# EAGLE design sds3_pcb_rev1 (EAGLE 6.4)
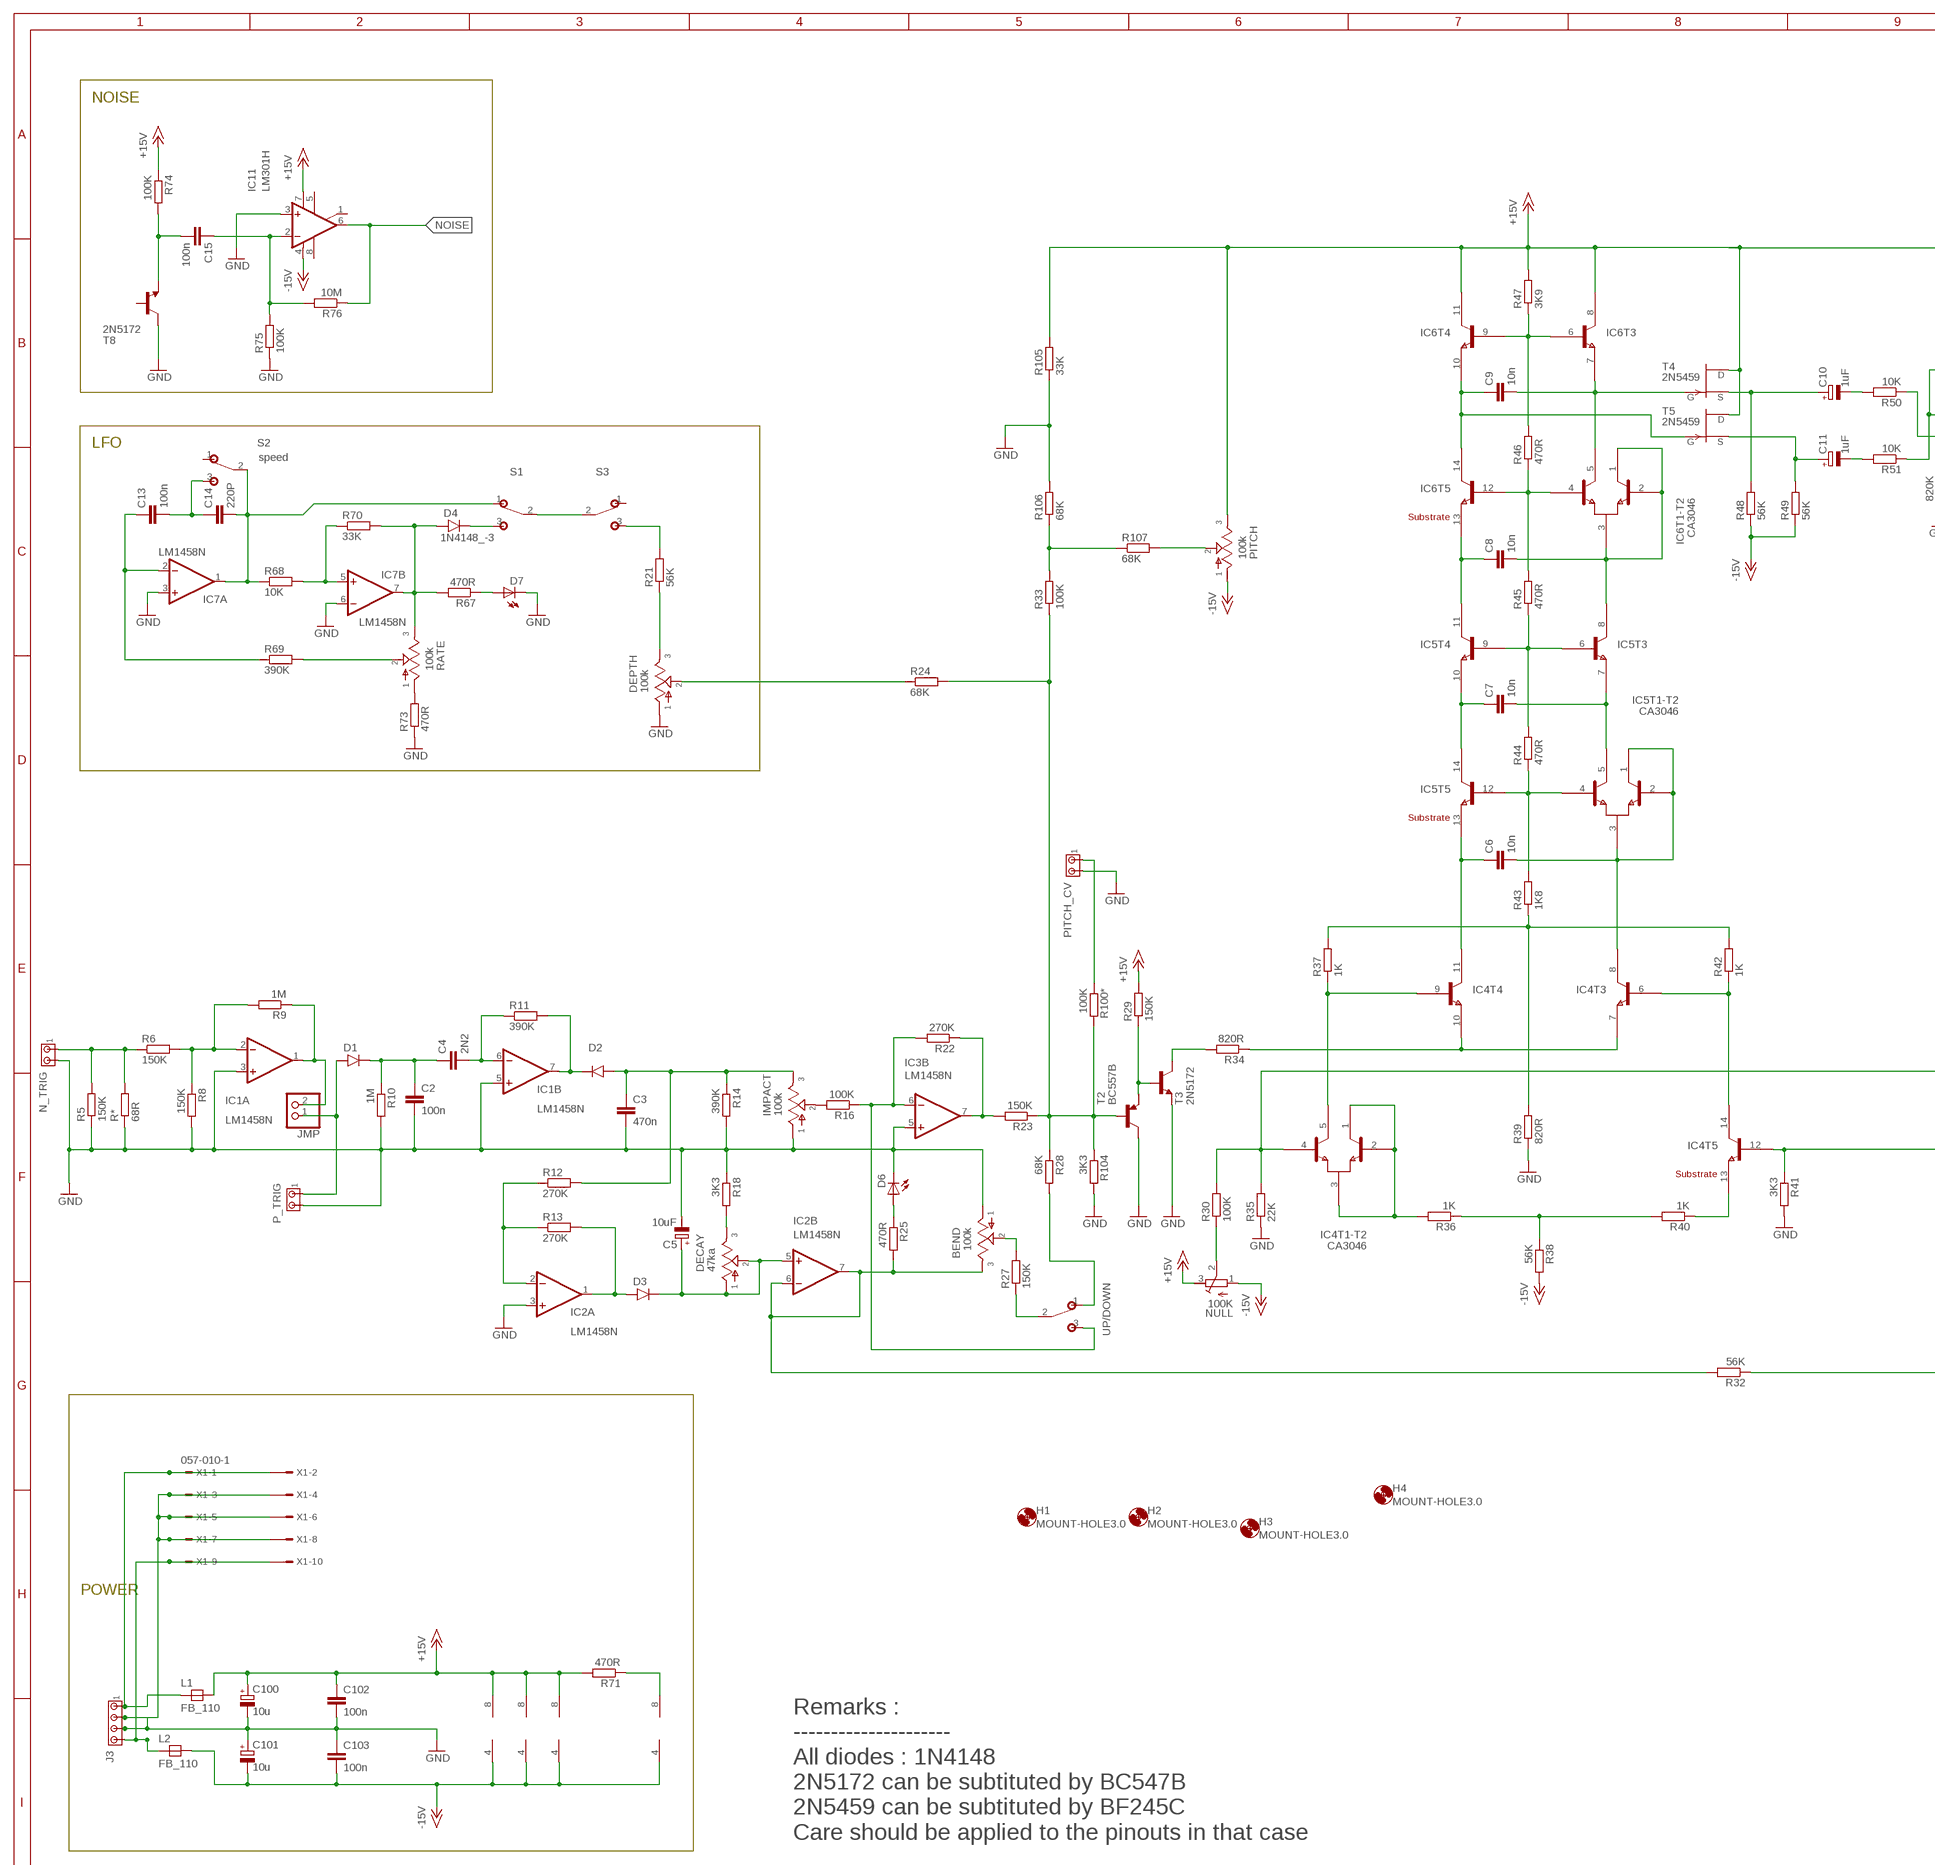
[diagram p0: schematic, sheet 1, part 1 of 2]
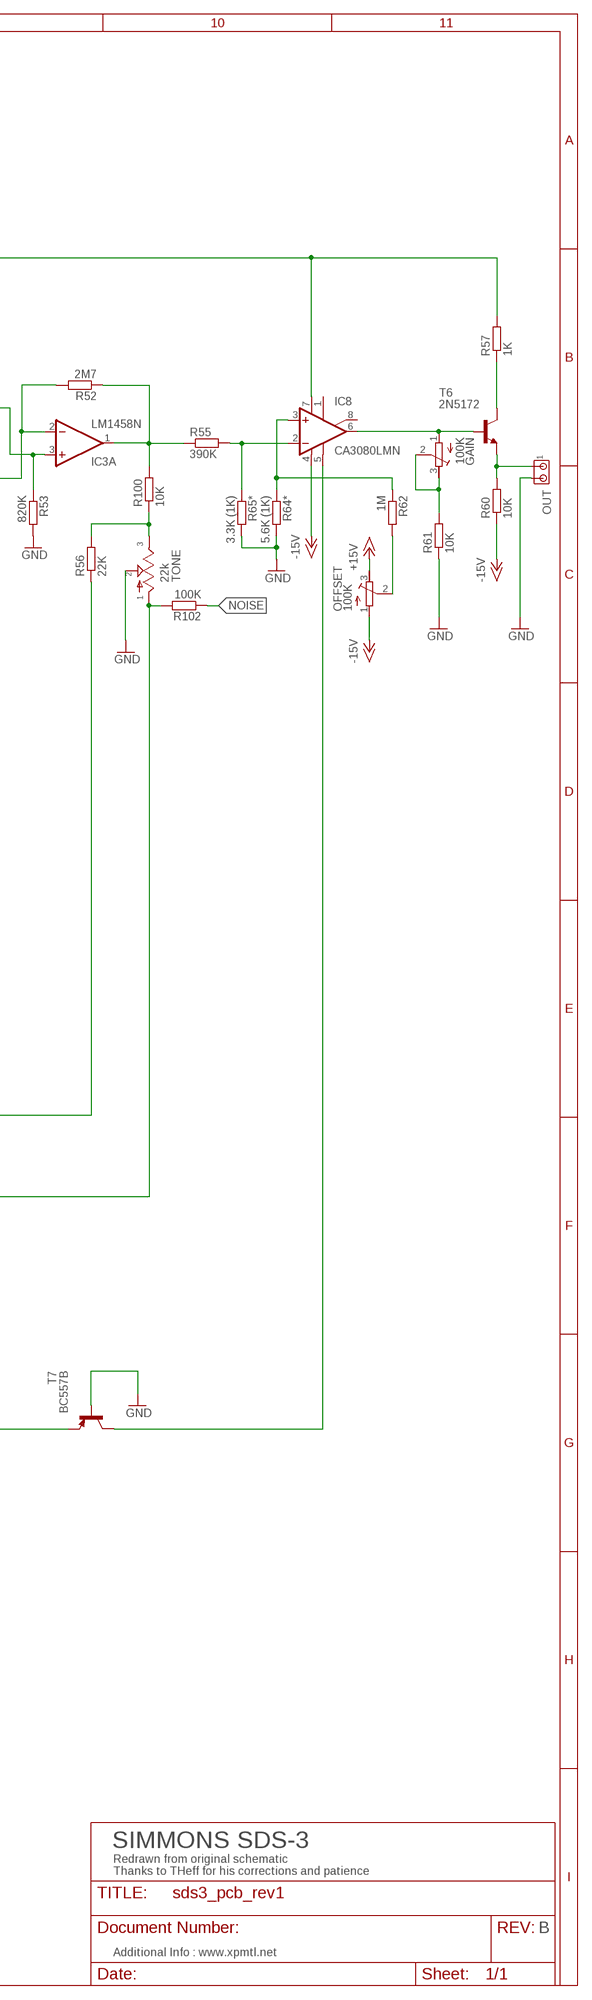
[diagram p1: schematic, sheet 1, part 2 of 2]

## Parts
BEND  100k  POT  [POT]
C2  100n  C-EU050-025X075  [C050-025X075]
C3  470n  C-EU050-025X075  [C050-025X075]
C4  2N2  C-EU050-025X075  [C050-025X075]
C5  10uF  CPOL-EUE2.5-6  [E2,5-6]
C6  10n  C-EU050-025X075  [C050-025X075]
C7  10n  C-EU050-025X075  [C050-025X075]
C8  10n  C-EU050-025X075  [C050-025X075]
C9  10n  C-EU050-025X075  [C050-025X075]
C10  1uF  CPOL-EUE2.5-6  [E2,5-6]
C11  1uF  CPOL-EUE2.5-6  [E2,5-6]
C13  100n  C-EU050-025X075  [C050-025X075]
C14  220P  C-EU050-025X075  [C050-025X075]
C15  100n  C-EU050-025X075  [C050-025X075]
C100  10u  CPOL-EUB45181A  [B45181A]
C101  10u  CPOL-EUB45181A  [B45181A]
C102  100n  C-EU050-025X075  [C050-025X075]
C103  100n  C-EU050-025X075  [C050-025X075]
D1  1N4148_-3  [DO35-3]
D2  1N4148_-3  [DO35-3]
D3  1N4148_-3  [DO35-3]
D4  1N4148_-3  [DO35-3]
D6  LED5MM  [LED5MM]
D7  LED5MM  [LED5MM]
DECAY  47ka  POT  [POT]
DEPTH  100k  POT  [POT]
GAIN  100K  R-TRIMM3296W  [RTRIM3296W]
H1  MOUNT-HOLE3.0  [3,0]
H2  MOUNT-HOLE3.0  [3,0]
H3  MOUNT-HOLE3.0  [3,0]
H4  MOUNT-HOLE3.0  [3,0]
IC1  LM1458N  [DIL08]
IC2  LM1458N  [DIL08]
IC3  LM1458N  [DIL08]
IC4  CA3046  [DIL14]
IC5  CA3046  [DIL14]
IC6  CA3046  [DIL14]
IC7  LM1458N  [DIL08]
IC8  CA3080LMN  [DIL08]
IC11  LM301H  [DIL08]
IMPACT  100k  POT  [POT]
J3  MTA04-156  [1X4MTA]
JMP  PINHD-1X2  [1X02]
L1  FB_110  [FB-110]
L2  FB_110  [FB-110]
N_TRIG  MTA02-100  [10X02MTA]
NULL  100K  R-TRIMM3296W  [RTRIM3296W]
OFFSET  100K  R-TRIMM3296W  [RTRIM3296W]
OUT  MTA02-100  [10X02MTA]
P_TRIG  MTA02-100  [10X02MTA]
PITCH  100k  POT  [POT]
PITCH_CV  MTA02-100  [10X02MTA]
R5  150K  R-EU_0309/V  [0309V]
R6  150K  R-EU_0309/V  [0309V]
R8  150K  R-EU_0309/V  [0309V]
R9  1M  R-EU_0309/V  [0309V]
R10  1M  R-EU_0309/V  [0309V]
R11  390K  R-EU_0309/V  [0309V]
R12  270K  R-EU_0309/V  [0309V]
R13  270K  R-EU_0309/V  [0309V]
R14  390K  R-EU_0309/V  [0309V]
R16  100K  R-EU_0309/V  [0309V]
R18  3K3  R-EU_0309/V  [0309V]
R21  56K  R-EU_0309/V  [0309V]
R22  270K  R-EU_0309/V  [0309V]
R23  150K  R-EU_0309/V  [0309V]
R24  68K  R-EU_0309/V  [0309V]
R25  470R  R-EU_0309/V  [0309V]
R27  150K  R-EU_0309/V  [0309V]
R28  68K  R-EU_0309/V  [0309V]
R29  150K  R-EU_0309/V  [0309V]
R30  100K  R-EU_0309/V  [0309V]
R32  56K  R-EU_0309/V  [0309V]
R33  100K  R-EU_0309/V  [0309V]
R34  820R  R-EU_0309/V  [0309V]
R35  22K  R-EU_0309/V  [0309V]
R36  1K  R-EU_0309/V  [0309V]
R37  1K  R-EU_0309/V  [0309V]
R38  56K  R-EU_0309/V  [0309V]
R39  820R  R-EU_0309/V  [0309V]
R40  1K  R-EU_0309/V  [0309V]
R41  3K3  R-EU_0309/V  [0309V]
R42  1K  R-EU_0309/V  [0309V]
R43  1K8  R-EU_0309/V  [0309V]
R44  470R  R-EU_0309/V  [0309V]
R45  470R  R-EU_0309/V  [0309V]
R46  470R  R-EU_0309/V  [0309V]
R47  3K9  R-EU_0309/V  [0309V]
R48  56K  R-EU_0309/V  [0309V]
R49  56K  R-EU_0309/V  [0309V]
R50  10K  R-EU_0309/V  [0309V]
R51  10K  R-EU_0309/V  [0309V]
R52  2M7  R-EU_0309/V  [0309V]
R53  820K  R-EU_0309/V  [0309V]
R55  390K  R-EU_0309/V  [0309V]
R56  22K  R-EU_0309/V  [0309V]
R57  1K  R-EU_0309/V  [0309V]
R60  10K  R-EU_0309/V  [0309V]
R61  10K  R-EU_0309/V  [0309V]
R62  1M  R-EU_0309/V  [0309V]
R64*  5.6K (1K)  R-EU_0309/V  [0309V]
R65*  3.3K (1K)  R-EU_0309/V  [0309V]
R67  470R  R-EU_0309/V  [0309V]
R68  10K  R-EU_0309/V  [0309V]
R69  390K  R-EU_0309/V  [0309V]
R70  33K  R-EU_0309/V  [0309V]
R71  470R  R-EU_0309/V  [0309V]
R73  470R  R-EU_0309/V  [0309V]
R74  100K  R-EU_0309/V  [0309V]
R75  100K  R-EU_0309/V  [0309V]
R76  10M  R-EU_0309/V  [0309V]
R100  10K  R-EU_0309/V  [0309V]
R100*  100K  R-EU_0309/V  [0309V]
R102  100K  R-EU_0309/V  [0309V]
R104  3K3  R-EU_0309/V  [0309V]
R105  33K  R-EU_0309/V  [0309V]
R106  68K  R-EU_0309/V  [0309V]
R107  68K  R-EU_0309/V  [0309V]
R*  68R  R-EU_0309/V  [0309V]
RATE  100k  POT  [POT]
S1  shape  SPDTPADS  [SPDT]
S2  speed  SPDTPADS  [SPDT]
S3  on/off  SPDTPADS  [SPDT]
T2  BC557B  [TO92-EBC]
T3  2N5172  [TO92-LINE]
T4  2N5459  [TO92-FET2]
T5  2N5459  [TO92-FET2]
T6  2N5172  [TO92-LINE]
T7  BC557B  [TO92-EBC]
T8  2N5172  [TO92-LINE]
TONE  22k  POT  [POT]
UP/DOWN  SPDTPADS  [SPDT]
X1  057-010-1  [057-010-1]

## Nets
+15V [nvcc]: C100.+ C102.1 IC1.8(P:V+) IC2.8(P:V+) IC3.8(P:V+) IC6.8(T3:C) IC6.11(T4:C) IC8.7(V+) IC11.7(V+) L1.2 NULL.3(E) OFFSET.3(E) PITCH.3 R29.2 R47.2 R57.2 R71.2 R74.1 R105.2 T4.D T5.D
-15V [nvcc]: C101.- C103.2 IC1.4(P:V-) IC2.4(P:V-) IC3.4(P:V-) IC7.4(P:V-) IC8.4(V-) IC11.4(V-) L2.2 NULL.1(A) OFFSET.1(A) PITCH.1 R38.2 R48.1 R49.1 R60.1
GND [gnd]: BEND.1 C2.2 C3.2 C5.- C100.- C101.+ C102.2 C103.1 D6.K(C) D7.K(C) DEPTH.1 IC1.3(A:+IN) IC1.5(B:+IN) IC2.3(A:+IN) IC3.5(B:+IN) IC7.3(A:+IN) IC7.6(B:-IN) IC11.3(+IN) IMPACT.1 J3.2 J3.3 N_TRIG.2 OUT.2 P_TRIG.2 PITCH_CV.2 R5.1 R8.2 R10.2 R14.2 R18.1 R35.1 R39.1 R41.2 R53.2 R61.1 R64*.2 R65*.2 R73.1 R75.1 R104.2 R105.1 R106.2 R*.1 T2.C T3.E T7.B T8.C TONE.2 X1.3 X1.4 X1.5 X1.6 X1.7 X1.8
N$1: C9.1 IC6.10(T4:E) IC6.14(T5:C) T5.G
N$2: IC6.4(T1-T2:B2) IC6.12(T5:B) R45.2 R46.1
N$3: C9.2 IC6.5(T1-T2:C2) IC6.7(T3:E) T4.G
N$4: IC6.6(T3:B) IC6.9(T4:B) R46.2 R47.1
N$5: C11.- R51.2
N$6: C8.1 IC5.11(T4:C) IC6.13(T5:E)
N$7: C8.2 IC5.8(T3:C) IC6.1(T1-T2:C1) IC6.2(T1-T2:B1) IC6.3(T1-T2:E)
N$8: IC5.6(T3:B) IC5.9(T4:B) R44.2 R45.1
N$9: C7.1 IC5.10(T4:E) IC5.14(T5:C)
N$10: C7.2 IC5.5(T1-T2:C2) IC5.7(T3:E)
N$11: IC5.4(T1-T2:B2) IC5.12(T5:B) R43.2 R44.1
N$12: C6.1 IC4.11(T4:C) IC5.13(T5:E)
N$13: C6.2 IC4.8(T3:C) IC5.1(T1-T2:C1) IC5.2(T1-T2:B1) IC5.3(T1-T2:E)
N$14: IC4.6(T3:B) IC4.14(T5:C) R42.1
N$15: IC4.5(T1-T2:C2) IC4.9(T4:B) R37.1
N$16: R37.2 R39.2 R42.2 R43.1
N$17: IC4.7(T3:E) IC4.10(T4:E) R34.1
N$18: IC4.1(T1-T2:C1) IC4.2(T1-T2:B1) IC4.3(T1-T2:E) R36.2
N$19: R36.1 R38.1 R40.2
N$20: IC4.13(T5:E) R40.1
N$22: IC4.4(T1-T2:B2) R30.2 R35.2 R56.1
N$23: C10.- R50.2
N$24: C10.+ R48.2 T4.S
N$25: C11.+ R49.2 T5.S
N$26: IC3.3(A:+IN) R50.1 R53.1
N$27: IC3.2(A:-IN) R51.1 R52.2
N$28: IC3.1(A:OUT) R52.1 R55.1 R100.2
N$29: IC8.2(-IN) R55.2 R65*.1
N$30: IC8.3(+IN) R62.1 R64*.1
N$31: GAIN.1(A) IC8.6(OUT) T6.B
N$32: R57.1 T6.C
N$33: OUT.1 R60.2 T6.E
N$34: R32.1 T7.E
N$35: IC8.5(OPT) T7.C
N$36: R56.2 R100.1 TONE.3
N$37: IC4.12(T5:B) R41.1 R102.2 TONE.1
N$38: OFFSET.2(S) R62.2
N$39: NULL.2(S) R30.1
N$40: R23.1 R24.2 R28.1 R33.1 R100*.2 R104.1 T2.B
N$41: R29.1 T2.E T3.B
N$42: R34.2 T3.C
N$43: IC3.7(B:OUT) R22.1 R23.2
N$44: IC3.6(B:-IN) R16.1 R22.2 UP/DOWN.3(S)
N$45: IC1.1(A:OUT) JMP.2 R9.1
N$46: IMPACT.2 R16.2
N$47: C3.1 D2.A IMPACT.3 R12.2 R14.1
N$48: D2.C IC1.7(B:OUT) R11.2
N$49: C4.2 IC1.6(B:-IN) R11.1
N$50: C2.1 C4.1 D1.C R10.1
N$51: IC2.2(A:-IN) R12.1 R13.1
N$52: IC1.2(A:-IN) R6.2 R8.1 R9.2
N$53: N_TRIG.1 R5.2 R6.1 R*.2
N$54: D3.A IC2.1(A:OUT) R13.2
N$55: BEND.3 IC2.6(B:-IN) IC2.7(B:OUT) R25.2 R32.2
N$56: C5.+ D3.C DECAY.1 DECAY.2 IC2.5(B:+IN)
N$57: DECAY.3 R18.2
N$58: D6.A R25.1
N$59: R27.1 UP/DOWN.2(P)
N$60: BEND.2 R27.2
N$61: R28.2 UP/DOWN.1(O)
N$62: R21.2 S3.3(S)
N$63: C15.2 R74.2 T8.E
N$64: C15.1 IC11.2(-IN) R75.2 R76.2
N$65: PITCH_CV.1 R100*.1
N$66: R73.2 RATE.1
N$67: GAIN.2(S) GAIN.3(E) R61.2
N$70: C14.2 IC7.1(A:OUT) R68.1 S1.1(O) S2.2(P)
N$71: IC7.5(B:+IN) R68.2 R70.1
N$72: D4.A IC7.7(B:OUT) R67.2 R70.2 RATE.3
N$74: R69.2 RATE.2
N$75: C13.1 IC7.2(A:-IN) R69.1
N$76: C13.2 C14.1 S2.3(S)
N$77: D4.C S1.3(S)
N$78: S1.2(P) S3.2(P)
N$79: DEPTH.3 R21.1
N$80: DEPTH.2 R24.1
N$81: PITCH.2 R107.2
N$82: R33.2 R106.1 R107.1
N$84: D7.A R67.1
N$86: J3.1 L1.1 X1.1 X1.2
N$87: J3.4 L2.1 X1.9 X1.10
N$88: IC7.8(P:V+) R71.1
N$89: D1.A JMP.1 P_TRIG.1
NOISE: IC11.6(OUT) R76.1 R102.1
Unconnected: IC8.1(ON1) IC8.8(ON2) IC11.1(ON/CMP) IC11.5(ON) IC11.8(CMP) S2.1(O) S3.1(O) T8.B

## Notes on the sheet
- NOISE
- LFO
- POWER
- SIMMONS SDS-3
- Redrawn from original schematic
  Thanks to THeff for his corrections and patience
- Remarks :
  ---------------------
  All diodes : 1N4148
  2N5172 can be subtituted by BC547B
  2N5459 can be subtituted by BF245C
  Care should be applied to the pinouts in that case
- B
- Additional Info : www.xpmtl.net

## Library data of the parts
BEND DECAY DEPTH IMPACT PITCH RATE TONE = gm-pots:POT: Potentiometers the arrow indicates the clockwise motion of th wiper (lug 2) fully counter clockwise there is no resistance between lugs 1 and 2 fully clockwise the resistance between lugs 1 and 2 is the value of the pot
C2-C4 C6-C9 = 1_Synth_DIY:C-EU: CAPACITOR, European symbol
C5 C10 C11 = 1_Synth_DIY:CPOL-EU: POLARIZED CAPACITOR, European symbol
C13-C15 C102 C103 = rcl:C-EU: CAPACITOR, European symbol
C100 C101 = rcl:CPOL-EU: POLARIZED CAPACITOR, European symbol
D1-D4 = 1_Synth_DIY:1N4148_: Fast Switching Diode DO-35 glass case a.k.a. 1N914
D6 D7 = led:LED: LED OSRAM: - CHIPLED LG R971, LG N971, LY N971, LG Q971, LY Q971, LO R971, LY R971 LH N974, LH R974 LS Q976, LO Q976, LY Q976 LO Q996 - Hyper CHIPLED LW Q18S LB Q993, LB Q99A, LB R99A - SideLED LS A670, LO A670, LY A670, LG A670, LP A670 LB A673, LV A673, LT A673, LW A673 LH A674 LY A675 LS A676, LA A676, LO A676, LY A676, LW A676 LS A679, LY A679, LG A679 - Hyper Micro SIDELED® LS Y876, LA Y876, LO Y876, LY Y876 LT Y87S - SmartLED LW L88C, LW L88S LB L89C, LB L89S, LG L890 LS L89K, LO L89K, LY L89K LS L896, LA L896, LO L896, LY L896 - TOPLED LS T670, LO T670, LY T670, LG T670, LP T670 LSG T670, LSP T670, LSY T670, LOP T670, LYG T670 LG T671, LOG T671, LSG T671 LB T673, LV T673, LT T673, LW T673 LH T674 LS T676, LA T676, LO T676, LY T676, LB T676, LH T676, LSB T676, LW T676 LB T67C, LV T67C, LT T67C, LS T67K, LO T67K, LY T67K, LW E67C LS E67B, LA E67B, LO E67B, LY E67B, LB E67C, LV E67C, LT E67C LW T67C LS T679, LY T679, LG T679 LS T770, LO T770, LY T770, LG T770, LP T770 LB T773, LV T773, LT T773, LW T773 LH T774 LS E675, LA E675, LY E675, LS T675 LS T776, LA T776, LO T776, LY T776, LB T776 LHGB T686 LT T68C, LB T68C - Hyper Mini TOPLED® LB M676 - Mini TOPLED Santana® LG M470 LS M47K, LO M47K, LY M47K Source: http://www.osram.convergy.de LUXEON: - LUMILED® LXK2-PW12-R00, LXK2-PW12-S00, LXK2-PW14-U00, LXK2-PW14-V00 LXK2-PM12-R00, LXK2-PM12-S00, LXK2-PM14-U00 LXK2-PE12-Q00, LXK2-PE12-R00, LXK2-PE12-S00, LXK2-PE14-T00, LXK2-PE14-U00 LXK2-PB12-K00, LXK2-PB12-L00, LXK2-PB12-M00, LXK2-PB14-N00, LXK2-PB14-P00, LXK2-PB14-Q00 LXK2-PR12-L00, LXK2-PR12-M00, LXK2-PR14-Q00, LXK2-PR14-R00 LXK2-PD12-Q00, LXK2-PD12-R00, LXK2-PD12-S00 LXK2-PH12-R00, LXK2-PH12-S00 LXK2-PL12-P00, LXK2-PL12-Q00, LXK2-PL12-R00 Source: www.luxeon.com KINGBRIGHT: KA-3528ASYC Source: www.kingbright.com
GAIN NULL OFFSET = 1_Synth_DIY:R-TRIMM: Trimm resistor
H1-H4 = holes:MOUNT-HOLE: MOUNTING HOLE with drill center marker
IC1-IC3 IC7 = linear:*1458: OP AMP
IC4-IC6 = 1_Synth_DIY:CA3046: NPN Transistor Array
IC8 = crowsynthparts:CA3080: OP AMP
IC11 = linear:LM301: OP AMP
J3 = con-amp:MTA04-156: AMP connector
JMP = pinhead:PINHD-1X2: PIN HEADER
L1 L2 = 1_Synth_DIY:FB_: FERRITE BEAD
N_TRIG OUT P_TRIG PITCH_CV = 1_Synth_DIY:MTA02-100: AMP connector
R5 R6 R8-R14 R16 R18 R21-R25 R27-R30 R32-R53 R55-R57 R60-R62 R64* R65* R67-R71 R73-R76 R100 R100* R102 R104-R107 R* = rcl:R-EU_: RESISTOR, European symbol
S1-S3 UP/DOWN = gm-switches:SPDT: TOGGLE SWITCH Marquardt
T2 T7 = transistor-pnp:BC557*: PNP Transistror
T3 T6 T8 = 1_Synth_DIY:2N5172: 2N5172 NPN Transistor
T4 T5 = 1_Synth_DIY:2N5459: 2N5458 FET Transistor
X1 = con-panduit:057-010-: CONNECTOR 10-pin series 057 contact pc board low profile headers; OC_FARNELL: unknown; OC_NEWARK: unknown

## Net classes
0 default: width 0.406 mm
1 gnd: width 0.61 mm
2 vcc: width 0.61 mm
3 nvcc: width 0.61 mm

## Board
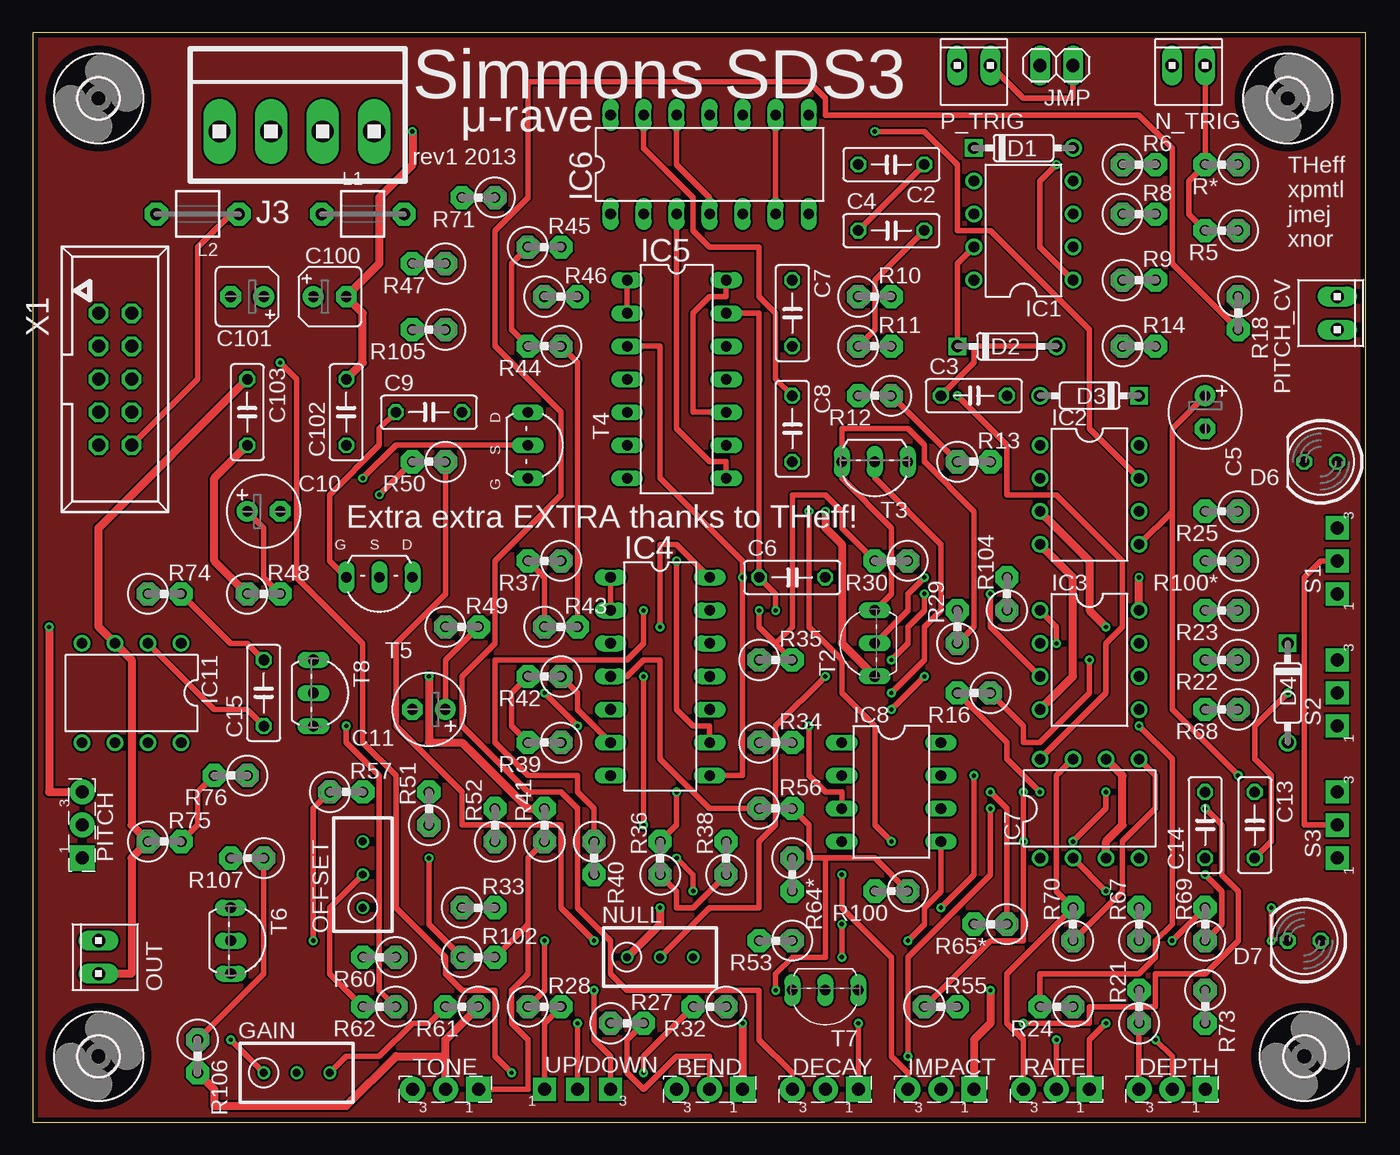
[diagram p2: board, top side]
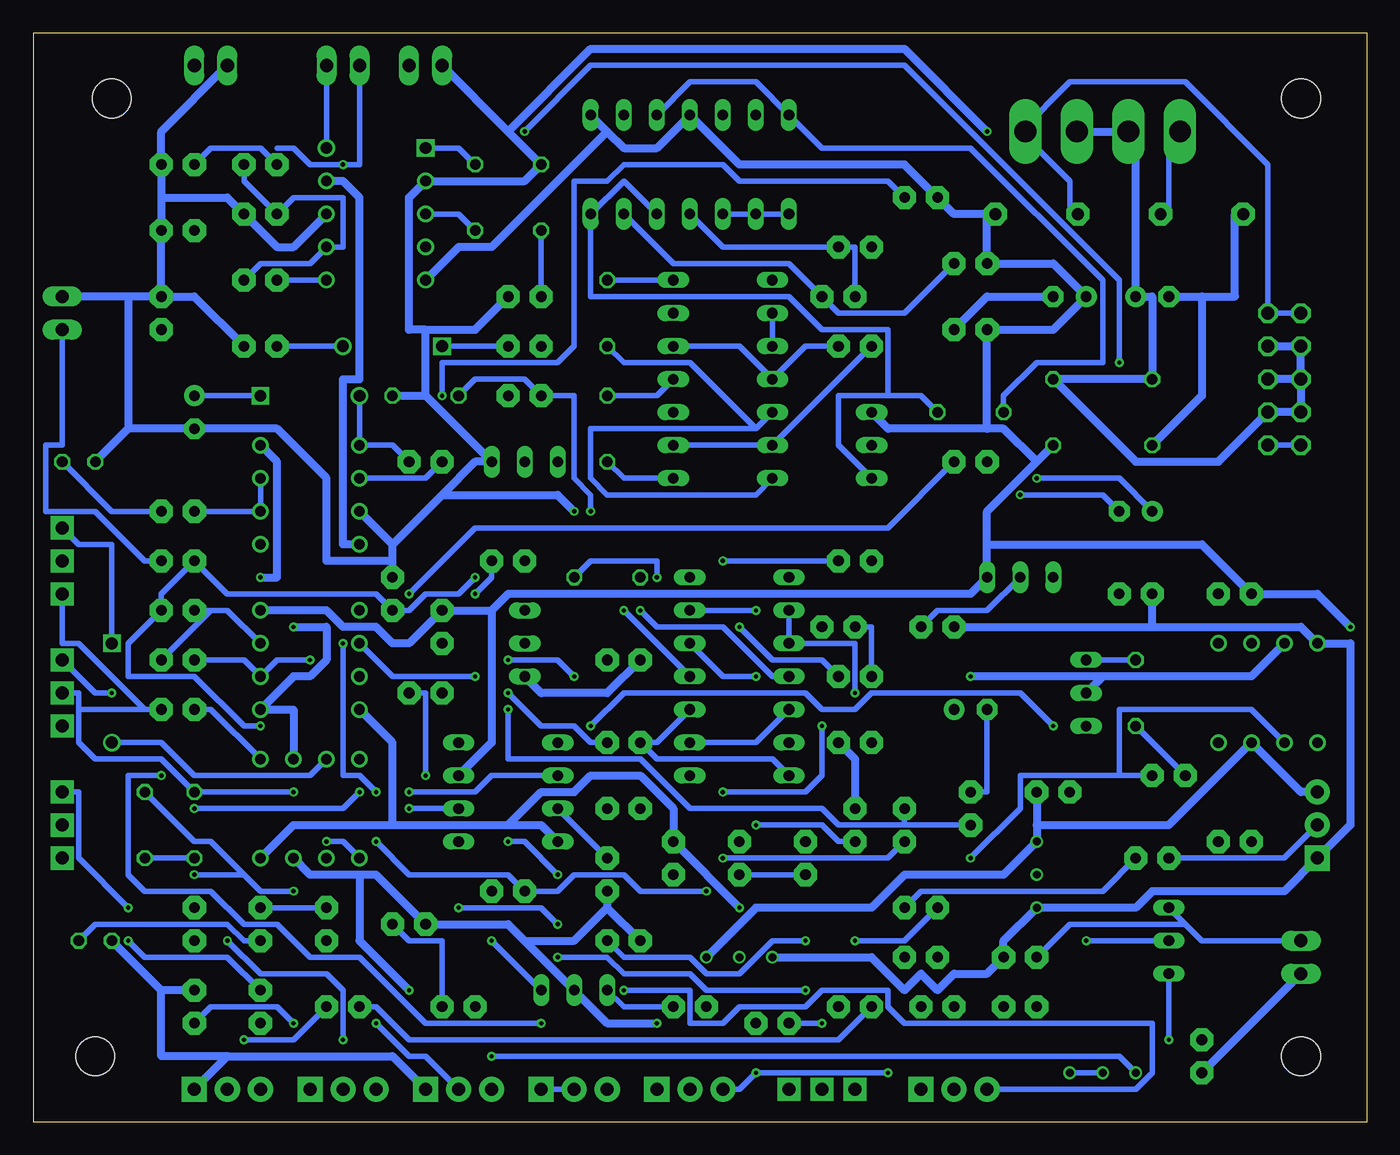
[diagram p3: board, bottom side, seen from below]

Size 102.54 x 83.81 mm. Coordinates in mm from the lower left corner, seen from the top.
Outline: 0,0 102.54,0 102.54,83.81 0,83.81 0,0
Copper layers (1*16): Top 0.0356mm / dielectric 1.5011mm / Bottom 0.0356mm
Design rules "LaenPCBOrder": minimum track width 6mil, minimum drill 13mil, track to track 6mil, track to pad 6mil, pad to pad 6mil, via to via 6mil, smd to smd 6mil, copper to edge 15mil, drill to drill 6mil, minimum pad ring 7mil, minimum via ring 7mil, stop-mask expansion 4mil, vias tented up to drill 0mil, thermal gap 10mil

### Footprints (pad centres in the part's own frame; a part is rotated, then mirrored left to right if it is on the bottom)
POT = drill 1 pad 1.93 square: 1 2.54,0 | drill 1 pad 1.93: 2 0,0; 3 -2.54,0
C050-025X075 = drill 0.813 octagon: 1 -2.54,0; 2 2.54,0
E2,5-6 = drill 0.813 pad 1.6: + -1.27,0 | drill 0.813 pad 1.6 octagon: - 1.27,0
B45181A = drill 0.813 pad 1.6: + -1.27,0 | drill 0.813 pad 1.6 octagon: - 1.27,0
DO35-3 = drill 0.9: A 3.81,0 | drill 0.9 square: C -3.81,0
LED5MM = drill 0.813 octagon: A -1.27,0; K 1.27,0
RTRIM3296W = drill 0.61: 1 0,-2.54; 2 0,0; 3 0,2.54
3,0 = hole 3: 0,0
DIL08 = drill 0.813 pad 1.27: 1 -3.81,-3.81; 2 -1.27,-3.81; 3 1.27,-3.81; 4 3.81,-3.81; 5 3.81,3.81; 6 1.27,3.81; 7 -1.27,3.81; 8 -3.81,3.81
DIL14 = drill 0.813 long: 1 -7.62,-3.81; 2 -5.08,-3.81; 3 -2.54,-3.81; 4 0,-3.81; 5 2.54,-3.81; 6 5.08,-3.81; 7 7.62,-3.81; 8 7.62,3.81; 9 5.08,3.81; 10 2.54,3.81; 11 0,3.81; 12 -2.54,3.81; 13 -5.08,3.81; 14 -7.62,3.81
DIL08' = drill 0.813 long: 1 -3.81,-3.81; 2 -1.27,-3.81; 3 1.27,-3.81; 4 3.81,-3.81; 5 3.81,3.81; 6 1.27,3.81; 7 -1.27,3.81; 8 -3.81,3.81
1X4MTA = drill 1.676 long: 1 5.944,0; 2 1.981,0; 3 -1.981,0; 4 -5.944,0
1X02 = drill 1.016 long: 1 -1.27,0; 2 1.27,0
FB-110 = drill 0.914 pad 1.778 octagon: 1 -3.175,0; 2 3.175,0
10X02MTA = drill 1.016 long: 1 1.27,0; 2 -1.27,0
0309V = drill 0.813 pad 1.778 octagon: 1 -1.27,0; 2 1.27,0
SPDT = drill 1 pad 1.778 square: 1 -2.54,0; 2 0,0; 3 2.54,0
TO92-EBC = drill 0.813 long: B 0,-1.27; C -2.54,-1.27; E 2.54,-1.27
TO92-LINE = drill 0.813 long: B 2.54,0; C 0,0; E -2.54,0
TO92-FET2 = drill 0.813 long: D -2.54,0; G 2.54,0; S 0,0
057-010-1 = drill 1 octagon: 1 -5.08,-1.27; 2 -5.08,1.27; 3 -2.54,-1.27; 4 -2.54,1.27; 5 0,-1.27; 6 0,1.27; 7 2.54,-1.27; 8 2.54,1.27; 9 5.08,-1.27; 10 5.08,1.27

### Placement (x,y rotation side)
BEND  52.07,2.54 0 top
C2  66.04,73.66 180 top
C3  72.39,55.88 0 top
C4  66.04,68.58 0 top
C5  90.17,54.61 270 top
C6  58.42,41.91 0 top
C7  58.42,62.23 270 top
C8  58.42,53.34 270 top
C9  30.48,54.61 0 top
C10  17.78,46.99 0 top
C11  30.48,31.75 180 top
C13  93.98,22.86 270 top
C14  90.17,22.86 90 top
C15  17.78,33.02 90 top
C100  22.86,63.5 0 top
C101  16.51,63.5 180 top
C102  24.13,54.61 90 top
C103  16.51,54.61 270 top
D1  76.2,74.93 0 top
D2  74.93,59.69 0 top
D3  81.28,55.88 180 top
D4  96.52,33.02 270 top
D6  99.06,50.8 180 top
D7  97.79,13.97 180 top
DECAY  60.96,2.54 0 top
DEPTH  87.63,2.54 0 top
GAIN  20.32,3.81 270 top
H1  5.08,5.08 0 top
H2  5.08,78.74 0 top
H3  97.79,5.08 0 top
H4  96.52,78.74 0 top
IC1  76.2,68.58 90 top
IC2  81.28,48.26 270 top
IC3  81.28,35.56 270 top
IC4  48.26,34.29 270 top
IC5  49.53,57.15 270 top
IC6  52.07,73.66 0 top
IC7  81.28,24.13 0 top
IC8  CA3080LMN  [DIL08']  66.04,25.4 270 top
IC11  7.62,33.02 180 top
IMPACT  69.85,2.54 0 top
J3  20.32,76.2 0 top
JMP  78.74,81.28 180 top
L1  25.4,69.85 0 top
L2  12.7,69.85 180 top
N_TRIG  88.9,81.28 0 top
NULL  48.26,12.7 270 top
OFFSET  25.4,19.05 0 top
OUT  5.08,12.7 90 top
P_TRIG  72.39,81.28 0 top
PITCH  3.81,22.86 270 top
PITCH_CV  100.33,62.23 270 top
R5  91.44,68.58 180 top
R6  85.09,73.66 0 top
R8  85.09,69.85 0 top
R9  85.09,64.77 0 top
R10  64.77,63.5 0 top
R11  64.77,59.69 0 top
R12  64.77,55.88 180 top
R13  72.39,50.8 0 top
R14  85.09,59.69 0 top
R16  72.39,33.02 180 top
R18  92.71,62.23 270 top
R21  85.09,8.89 90 top
R22  91.44,35.56 180 top
R23  91.44,39.37 180 top
R24  78.74,8.89 180 top
R25  91.44,46.99 180 top
R27  45.72,7.62 0 top
R28  39.37,8.89 0 top
R29  71.12,38.1 90 top
R30  66.04,43.18 180 top
R32  52.07,8.89 180 top
R33  34.29,16.51 0 top
R34  57.15,29.21 0 top
R35  57.15,35.56 0 top
R36  48.26,20.32 90 top
R37  39.37,43.18 180 top
R38  53.34,20.32 90 top
R39  39.37,29.21 180 top
R40  43.18,20.32 270 top
R41  39.37,22.86 90 top
R42  39.37,34.29 180 top
R43  40.64,38.1 0 top
R44  39.37,59.69 180 top
R45  39.37,67.31 0 top
R46  40.64,63.5 0 top
R47  30.48,66.04 180 top
R48  17.78,40.64 0 top
R49  33.02,38.1 0 top
R50  30.48,50.8 180 top
R51  30.48,24.13 90 top
R52  35.56,22.86 90 top
R53  57.15,13.97 180 top
R55  69.85,8.89 0 top
R56  57.15,24.13 0 top
R57  24.13,25.4 0 top
R60  26.67,12.7 180 top
R61  33.02,8.89 180 top
R62  26.67,8.89 180 top
R64*  58.42,19.05 270 top
R65*  73.66,15.24 180 top
R67  85.09,15.24 90 top
R68  91.44,31.75 180 top
R69  90.17,15.24 90 top
R70  80.01,15.24 90 top
R71  34.29,71.12 180 top
R73  90.17,8.89 270 top
R74  10.16,40.64 0 top
R75  10.16,21.59 0 top
R76  15.24,26.67 180 top
R100  66.04,17.78 180 top
R100*  91.44,43.18 180 top
R102  34.29,12.7 0 top
R104  74.93,40.64 90 top
R105  30.48,60.96 180 top
R106  12.7,5.08 270 top
R107  16.51,20.32 180 top
R*  91.44,73.66 180 top
RATE  78.74,2.54 0 top
S1  100.33,43.18 90 top
S2  100.33,33.02 90 top
S3  100.33,22.86 90 top
T2  63.5,36.83 90 top
T3  64.77,50.8 180 top
T4  38.1,52.07 270 top
T5  26.67,41.91 180 top
T6  15.24,13.97 270 top
T7  60.96,8.89 180 top
T8  21.59,33.02 270 top
TONE  31.75,2.54 0 top
UP/DOWN  41.91,2.54 0 top
X1  6.35,57.15 270 top

### Tracks (layer width: path | path; a pad name or v marks a point on that pad's centre or on a via)
+15V  (via drill 0.33)
  Top 0.61: IC3.8 v85.09,41.91 | PITCH.3 1.27,25.4 v1.27,38.1
  Bottom 0.61: PITCH.3 5.08,25.4 IC11.7 15.24,22.86 25.4,22.86 | R57.2 25.4,22.86 | 25.4,22.86 OFFSET.3 27.94,19.05 35.56,19.05 38.1,16.51 46.99,16.51 NULL.3 | IC8.7 67.31,29.21 67.31,39.37 | 67.31,39.37 R29.2 73.66,36.83 74.93,36.83 76.2,38.1 78.74,38.1 80.01,39.37 IC3.8 | IC2.8 83.82,50.8 83.82,41.91 v85.09,41.91 | IC6.8 58.42,76.2 | 58.42,76.2 57.15,74.93 54.61,74.93 IC6.11 48.26,73.66 35.56,73.66 R71.2 31.75,69.85 29.21,69.85 | IC1.8 69.85,67.31 67.31,67.31 58.42,76.2 | 29.21,69.85 R47.2 24.13,66.04 C100.+ 24.13,60.96 R105.2 29.21,53.34 | 29.21,69.85 L1.2 | 25.4,50.8 29.21,46.99 29.21,44.45 | 25.4,50.8 C102.1 | 29.21,44.45 T5.D 30.48,40.64 66.04,40.64 67.31,39.37 | T4.D 36.83,53.34 29.21,53.34 | 29.21,53.34 27.94,53.34 25.4,50.8 | 29.21,44.45 12.7,44.45 R74.1 3.81,40.64 v1.27,38.1
-15V  (via drill 0.33)
  Top 0.61: C103.2 13.97,49.53 13.97,43.18 R48.1 | NULL.1 48.26,15.24 v48.26,16.51 | IC2.4 80.01,41.91 80.01,34.29 IC3.4
  Bottom 0.61: C103.2 12.7,55.88 12.7,63.5 | C101.- 12.7,63.5 | 12.7,63.5 10.16,63.5 10.16,69.85 L2.2 | R49.1 16.51,38.1 | 16.51,38.1 5.08,38.1 IC11.4 1.27,36.83 1.27,22.86 PITCH.1 6.35,17.78 16.51,17.78 17.78,16.51 OFFSET.1 27.94,13.97 R60.1 29.21,11.43 31.75,11.43 33.02,10.16 34.29,11.43 35.56,10.16 38.1,12.7 NULL.1 | 16.51,38.1 R48.1 | v48.26,16.51 R38.2 53.34,24.13 55.88,26.67 59.69,26.67 60.96,25.4 63.5,25.4 66.04,22.86 | IC8.4 63.5,22.86 66.04,22.86 | 74.93,22.86 82.55,22.86 IC7.4 | 74.93,22.86 66.04,22.86 | IC3.4 74.93,29.21 74.93,22.86 | IC1.4 78.74,72.39 77.47,71.12 77.47,57.15 78.74,57.15 78.74,44.45 IC2.4
GND  (via drill 0.33)
  Top 0.61: C102.2 25.4,58.42 25.4,62.23 C100.- 26.67,66.04 26.67,71.12 29.21,73.66 v29.21,76.2 | R61.1 31.75,6.35 31.75,5.08 | TONE.2 31.75,5.08 | 31.75,5.08 27.94,5.08 24.13,1.27 13.97,1.27 13.97,2.54 R106.2 | R41.2 38.1,24.13 33.02,29.21 30.48,29.21 v30.48,34.29 | OUT.2 7.62,11.43 7.62,20.32 R75.1 7.62,22.86 7.62,35.56 IC11.3 5.08,38.1 5.08,45.72 C103.1 | v54.61,7.62 BEND.1 | IC7.6 83.82,26.67 83.82,22.86 82.55,21.59 IC7.3 | IMPACT.1 72.39,6.35 73.66,7.62 v73.66,10.16 | T2.C 62.23,36.83 62.23,44.45 60.96,45.72 v60.96,46.99 | v82.55,38.1 81.28,39.37 81.28,43.18 IC2.3
  Bottom 0.61: C100.- 29.21,63.5 R105.1 | J3.2 J3.3 17.78,76.2 C101.+ 16.51,63.5 C103.1 C102.2 17.78,50.8 11.43,50.8 X1.8 X1.7 X1.5 | X1.4 X1.3 X1.5 | X1.5 X1.6 | R106.2 OUT.2 | R41.2 39.37,27.94 R39.1 | 20.32,34.29 T8.C | 20.32,34.29 8.89,34.29 IC11.3 | 20.32,34.29 v30.48,34.29 | 92.71,10.16 D7.K | R73.1 92.71,10.16 | IMPACT.1 74.93,5.08 87.63,5.08 | DEPTH.1 87.63,5.08 | 92.71,10.16 92.71,5.08 87.63,5.08 | 58.42,16.51 R53.2 | R64*.2 58.42,16.51 | IC7.6 82.55,31.75 IC3.5 82.55,34.29 81.28,34.29 80.01,35.56 80.01,38.1 v82.55,38.1 | 64.77,13.97 66.04,15.24 R65*.2 76.2,19.05 77.47,19.05 | 64.77,13.97 T7.B 58.42,7.62 v54.61,7.62 | IC7.3 81.28,19.05 77.47,19.05 | 58.42,16.51 60.96,13.97 64.77,13.97 | v73.66,10.16 77.47,13.97 77.47,19.05 | IC1.3 82.55,67.31 83.82,67.31 R8.2 87.63,71.12 92.71,71.12 | N_TRIG.2 92.71,76.2 R*.1 92.71,71.12 | 92.71,71.12 R5.1 R18.1 | 95.25,53.34 D6.K | 95.25,53.34 C5.- 83.82,53.34 80.01,49.53 80.01,43.18 74.93,43.18 | R18.1 95.25,63.5 | 95.25,63.5 PITCH_CV.2 | R14.2 90.17,63.5 R18.1 | 95.25,63.5 95.25,53.34 | 66.04,76.2 C2.2 64.77,72.39 IC1.5 73.66,71.12 73.66,60.96 72.39,60.96 | 66.04,76.2 P_TRIG.2 | T2.C 63.5,33.02 58.42,33.02 R35.1 | 74.93,44.45 IC2.3 | R104.2 74.93,43.18 | 74.93,43.18 74.93,44.45 | 72.39,55.88 T3.E 68.58,50.8 71.12,48.26 | C3.2 72.39,55.88 | R10.2 68.58,60.96 72.39,60.96 | 72.39,55.88 72.39,60.96 | 71.12,48.26 74.93,44.45 | v60.96,46.99 62.23,48.26 71.12,48.26 | v29.21,76.2 35.56,82.55 59.69,82.55 66.04,76.2
N$1
  Top 0.406: T5.G 22.86,43.18 22.86,48.26 26.67,52.07 26.67,53.34 C9.1
  Bottom 0.406: IC6.10 52.07,80.01 46.99,80.01 IC6.14 41.91,74.93 30.48,74.93 20.32,64.77 20.32,58.42 25.4,58.42 27.94,55.88 C9.1
N$2
  Top 0.406: IC6.12 49.53,73.66 52.07,71.12 IC6.4
  Bottom 0.406: IC6.4 49.53,67.31 R45.2 39.37,67.31 R46.1
N$3
  Bottom 0.406: IC6.5 57.15,72.39 IC6.7 59.69,63.5 44.45,63.5 41.91,60.96 36.83,60.96 36.83,55.88 | T4.G 40.64,52.07 40.64,55.88 36.83,55.88 | 36.83,55.88 34.29,55.88 C9.2
N$4
  Top 0.406: IC6.6 IC6.9
  Bottom 0.406: IC6.6 53.34,66.04 44.45,66.04 R46.2 40.64,62.23 35.56,62.23 R47.1
N$5
  Bottom 0.406: C11.- 29.21,25.4 R51.2
N$6
  Top 0.406: IC6.13 46.99,74.93 50.8,71.12 50.8,68.58 52.07,67.31 55.88,67.31 55.88,63.5 57.15,62.23 57.15,57.15 C8.1
  Bottom 0.406: IC5.11 54.61,55.88 C8.1
N$7
  Top 0.406: IC6.3 49.53,53.34 52.07,50.8 53.34,50.8 IC5.8
  Bottom 0.406: IC6.1 IC6.2 IC6.3 | IC5.8 57.15,49.53 C8.2
N$8
  Top 0.406: R45.1 36.83,66.04 36.83,60.96 R44.2
  Bottom 0.406: IC5.9 IC5.6 R44.2
N$9
  Top 0.406: IC5.10 50.8,54.61 50.8,62.23 52.07,63.5 53.34,63.5 IC5.14
  Bottom 0.406: IC5.14 C7.1
N$10
  Bottom 0.406: IC5.7 46.99,48.26 58.42,48.26 59.69,49.53 59.69,53.34 46.99,53.34 | IC5.5 46.99,53.34 | C7.2 57.15,58.42 52.07,58.42 46.99,53.34
N$11
  Top 0.406: R43.2 41.91,58.42 R44.1
  Bottom 0.406: R44.1 43.18,59.69 IC5.4 48.26,59.69 IC5.12
N$12  (via drill 0.33)
  Top 0.406: v57.15,39.37 57.15,40.64 C6.1 55.88,62.23 IC5.13
  Bottom 0.406: v57.15,39.37 IC4.11
N$13  (via drill 0.33)
  Top 0.406: IC5.2 IC5.1 | IC4.8 54.61,26.67 v54.61,41.91 54.61,43.18 48.26,49.53 48.26,59.69 IC5.3
  Bottom 0.406: IC5.2 IC5.3 | v54.61,41.91 54.61,43.18 59.69,43.18 C6.2
N$14  (via drill 0.33)
  Top 0.406: IC4.6 41.91,31.75 41.91,33.02 R42.1 | IC4.14 49.53,44.45 48.26,44.45 v48.26,38.1
  Bottom 0.406: v48.26,38.1 45.72,35.56 41.91,35.56 R42.1
N$15  (via drill 0.33)
  Top 0.406: v49.53,43.18 49.53,31.75 50.8,30.48 52.07,30.48 IC4.9
  Bottom 0.406: IC4.5 46.99,29.21 IC4.9 | v49.53,43.18 R37.1
N$16
  Top 0.406: R39.2 36.83,30.48 36.83,33.02 R42.2 | R37.2 39.37,41.91 R43.1
  Bottom 0.406: R42.2 38.1,38.1 R43.1
N$17
  Bottom 0.406: IC4.7 45.72,27.94 54.61,27.94 R34.1 54.61,29.21 IC4.10
N$18  (via drill 0.33)
  Top 0.406: IC4.2 IC4.1 | R36.2 49.53,22.86 v49.53,25.4 | v39.37,33.02 v41.91,30.48
  Bottom 0.406: IC4.2 IC4.3 39.37,36.83 v39.37,33.02 | v49.53,25.4 43.18,25.4 41.91,26.67 v41.91,30.48
N$19
  Top 0.406: R38.1 50.8,16.51 49.53,16.51 49.53,17.78 R36.1
  Bottom 0.406: R36.1 R40.2
N$20  (via drill 0.33)
  Top 0.406: v46.99,39.37 46.99,36.83 45.72,35.56 35.56,35.56 35.56,29.21 38.1,26.67 41.91,26.67 41.91,25.4 43.18,24.13 R40.1
  Bottom 0.406: v46.99,39.37 IC4.13
N$21
  pour Top: 0,83.82 102.87,83.82 102.87,0 0,0
N$22  (via drill 0.33)
  Top 0.406: IC4.4 45.72,34.29 46.99,35.56 48.26,35.56 48.26,27.94 52.07,24.13 R56.1 | 57.15,36.83 55.88,38.1 v55.88,39.37 | 57.15,36.83 R35.2 | R30.2 62.23,45.72 62.23,46.99 60.96,48.26 58.42,48.26 58.42,38.1 57.15,36.83
  Bottom 0.406: v55.88,39.37 54.61,38.1 49.53,38.1 45.72,34.29 IC4.4
N$23  (via drill 0.33)
  Top 0.406: R50.2 v26.67,48.26
  Bottom 0.406: C10.- 20.32,48.26 v26.67,48.26
N$24  (via drill 0.33)
  Top 0.406: T4.S 27.94,52.07 v25.4,49.53 | R48.2 17.78,41.91 17.78,45.72 C10.+
  Bottom 0.406: v25.4,49.53 19.05,49.53 C10.+
N$25
  Top 0.406: C11.+ 31.75,35.56 R49.2
  Bottom 0.406: T5.S 29.21,39.37 33.02,39.37 R49.2
N$26  (via drill 0.33)
  Top 0.406: IC3.3 73.66,38.1 v73.66,40.64 | v43.18,13.97 40.64,16.51 40.64,22.86 33.02,22.86 33.02,25.4 27.94,30.48 27.94,36.83 31.75,40.64 R50.1
  Bottom 0.406: v73.66,40.64 68.58,45.72 36.83,45.72 R50.1 | R53.1 57.15,12.7 52.07,12.7 50.8,11.43 48.26,11.43 45.72,13.97 v43.18,13.97
N$27  (via drill 0.33)
  Top 0.406: v66.04,31.75 v68.58,34.29
  Bottom 0.406: IC3.2 74.93,34.29 v68.58,34.29 | v66.04,31.75 66.04,27.94 55.88,27.94 52.07,24.13 41.91,24.13 40.64,22.86 35.56,22.86 | R51.1 35.56,22.86 | 35.56,22.86 R52.2
N$28  (via drill 0.33)
  Top 0.406: IC3.1 78.74,38.1 v78.74,36.83 | v76.2,25.4 v76.2,21.59 76.2,13.97 73.66,13.97 R55.1 | v49.53,20.32 50.8,19.05 v50.8,17.78
  Bottom 0.406: v78.74,36.83 78.74,26.67 77.47,26.67 v76.2,25.4 | v76.2,21.59 73.66,19.05 66.04,19.05 R100.2 62.23,17.78 60.96,19.05 57.15,19.05 55.88,17.78 v50.8,17.78 | R52.1 36.83,20.32 v49.53,20.32
N$29  (via drill 0.33)
  Top 0.406: v73.66,25.4 74.93,24.13 R65*.1
  Bottom 0.406: IC8.2 67.31,26.67 68.58,25.4 v73.66,25.4 | R55.2 71.12,13.97 73.66,13.97 R65*.1
N$30  (via drill 0.33)
  Top 0.406: R62.1 26.67,10.16 26.67,26.67 24.13,29.21 v24.13,30.48 | v59.69,30.48 59.69,26.67 60.96,25.4 62.23,25.4 IC8.3
  Bottom 0.406: R64*.1 IC8.3 | v24.13,30.48 26.67,33.02 38.1,33.02 39.37,31.75 41.91,31.75 43.18,33.02 57.15,33.02 v59.69,30.48
N$31  (via drill 0.33)
  Top 0.406: v15.24,6.35 GAIN.1 | v73.66,24.13 73.66,19.05 67.31,12.7 v67.31,5.08
  Bottom 0.406: T6.B v15.24,6.35 | v73.66,24.13 IC8.6 | v67.31,5.08 19.05,5.08 GAIN.1
N$32  (via drill 0.33)
  Top 0.406: v21.59,13.97 21.59,24.13 R57.1
  Bottom 0.406: v21.59,13.97 T6.C
N$33
  Bottom 0.406: 13.97,15.24 12.7,13.97 OUT.1 | 13.97,15.24 T6.E | R60.2 22.86,15.24 13.97,15.24
N$34
  Bottom 0.406: T7.E 57.15,8.89 R32.1
N$35  (via drill 0.33)
  Top 0.406: v67.31,13.97 68.58,15.24 68.58,16.51 69.85,17.78 IC8.5
  Bottom 0.406: v67.31,13.97 T7.C
N$36  (via drill 0.33)
  Top 0.406: R100.1 64.77,20.32 60.96,20.32 | 60.96,20.32 59.69,20.32 59.69,22.86 R56.2 | v57.15,10.16 57.15,11.43 58.42,12.7 60.96,12.7 60.96,20.32
  Bottom 0.406: TONE.3 17.78,2.54 16.51,3.81 16.51,7.62 35.56,7.62 36.83,8.89 36.83,10.16 41.91,10.16 43.18,8.89 48.26,8.89 49.53,7.62 52.07,7.62 52.07,10.16 v57.15,10.16
N$37  (via drill 0.33)
  Top 0.406: v46.99,22.86 v46.99,34.29 | 38.1,15.24 R102.2 | 38.1,15.24 38.1,20.32 R41.1 | TONE.1 38.1,2.54 38.1,6.35 36.83,7.62 36.83,10.16 38.1,11.43 38.1,15.24
  Bottom 0.406: IC4.12 49.53,34.29 v46.99,34.29 | v46.99,22.86 41.91,22.86 40.64,21.59 R41.1
N$38
  Top 0.406: OFFSET.2 22.86,16.51 22.86,11.43 R62.2
N$39  (via drill 0.33)
  Top 0.406: NULL.2 52.07,16.51 55.88,16.51 55.88,21.59 57.15,22.86 57.15,30.48 v60.96,34.29 | v66.04,35.56 67.31,36.83 67.31,38.1 68.58,39.37 v68.58,40.64
  Bottom 0.406: v60.96,34.29 62.23,35.56 v66.04,35.56 | v68.58,40.64 67.31,41.91 R30.1
N$40  (via drill 0.33)
  Top 0.406: T2.B 67.31,39.37 67.31,40.64 v68.58,41.91 | v39.37,13.97 39.37,10.16 R28.1 | v85.09,30.48 87.63,27.94 87.63,15.24 86.36,13.97 86.36,12.7 85.09,11.43 77.47,11.43 R24.2
  Bottom 0.406: v68.58,41.91 69.85,40.64 72.39,40.64 73.66,39.37 R104.1 76.2,40.64 87.63,40.64 R100*.2 92.71,40.64 R23.1 95.25,36.83 95.25,34.29 90.17,34.29 86.36,30.48 v85.09,30.48 | R28.1 40.64,6.35 73.66,6.35 76.2,8.89 R24.2 | R33.1 35.56,13.97 v39.37,13.97
N$41
  Top 0.406: T2.E 66.04,40.64 66.04,45.72 62.23,49.53 T3.B 62.23,53.34 67.31,53.34 68.58,52.07 68.58,50.8 72.39,46.99 72.39,38.1 R29.1
N$42  (via drill 0.33)
  Top 0.406: T3.C 64.77,49.53 69.85,44.45 69.85,39.37 68.58,38.1 68.58,35.56 v66.04,33.02
  Bottom 0.406: v66.04,33.02 63.5,30.48 60.96,30.48 59.69,29.21 R34.2
N$43
  Bottom 0.406: IC3.7 87.63,39.37 88.9,39.37 | R23.2 88.9,39.37 | 88.9,39.37 R22.1
N$44  (via drill 0.33)
  Top 0.406: UP/DOWN.3 44.45,5.08 43.18,6.35 v43.18,10.16 | v62.23,15.24 v62.23,12.7 | v69.85,16.51 72.39,19.05 v72.39,26.67 | v81.28,35.56 81.28,33.02 77.47,29.21 76.2,29.21 76.2,30.48 R16.1
  Bottom 0.406: R22.2 86.36,35.56 IC3.6 83.82,35.56 v81.28,35.56 | v43.18,10.16 50.8,10.16 52.07,11.43 57.15,11.43 58.42,12.7 v62.23,12.7 | v62.23,15.24 63.5,16.51 v69.85,16.51 | v72.39,26.67 72.39,33.02 R16.1
N$45  (via drill 0.33)
  Top 0.406: v78.74,73.66 77.47,72.39 77.47,67.31 IC1.1
  Bottom 0.406: R9.1 IC1.1 | 83.82,74.93 82.55,74.93 81.28,73.66 v78.74,73.66 77.47,73.66 JMP.2
N$46  (via drill 0.33)
  Top 0.406: R16.2 74.93,29.21 74.93,27.94 v77.47,25.4 | v90.17,24.13 91.44,22.86 91.44,19.05 92.71,17.78 92.71,13.97 90.17,11.43 86.36,11.43 86.36,8.89 81.28,8.89 81.28,7.62 v76.2,7.62
  Bottom 0.406: v77.47,25.4 78.74,24.13 v90.17,24.13 | v76.2,7.62 73.66,5.08 72.39,5.08 IMPACT.2
N$47  (via drill 0.33)
  Top 0.406: IMPACT.3 67.31,3.81 66.04,5.08 66.04,12.7 62.23,16.51 v62.23,19.05 | v66.04,21.59 64.77,22.86 64.77,30.48 62.23,33.02 62.23,35.56 59.69,38.1 v59.69,46.99 | D2.A 72.39,59.69 72.39,58.42 C3.1
  Bottom 0.406: R14.1 D2.A | C3.1 68.58,57.15 64.77,57.15 R12.2 60.96,55.88 60.96,49.53 59.69,48.26 v59.69,46.99 | v62.23,19.05 64.77,21.59 v66.04,21.59
N$48
  Top 0.406: IC1.7 71.12,66.04 D2.C
  Bottom 0.406: D2.C R11.2
N$49
  Top 0.406: R11.1 64.77,60.96 64.77,64.77 C4.2
  Bottom 0.406: C4.2 69.85,69.85 IC1.6
N$50
  Top 0.406: C4.1 C2.1
  Bottom 0.406: C2.1 69.85,74.93 D1.C | R10.1 C4.1
N$51
  Top 0.406: R13.1 R12.1
  Bottom 0.406: IC2.2 72.39,49.53 R13.1
N$52
  Bottom 0.406: R6.2 86.36,72.39 R8.1 82.55,71.12 78.74,71.12 78.74,67.31 IC1.2 81.28,66.04 85.09,66.04 R9.2
N$53
  Top 0.406: N_TRIG.1 R*.2 88.9,72.39 88.9,69.85 R5.2
  Bottom 0.406: R6.1 85.09,74.93 88.9,74.93 R*.2
N$54
  Bottom 0.406: D3.A IC2.1 74.93,52.07 R13.2
N$55  (via drill 0.33)
  Top 0.406: R32.2 46.99,5.08 v46.99,3.81 | IC2.7 81.28,53.34 81.28,60.96 73.66,68.58 71.12,68.58 71.12,73.66 68.58,76.2 v64.77,76.2 | v19.05,58.42 20.32,57.15 20.32,41.91 25.4,36.83 25.4,29.21 27.94,26.67 27.94,16.51 31.75,12.7 31.75,11.43 33.02,10.16 35.56,10.16 35.56,5.08 v36.83,3.81
  Bottom 0.406: IC2.7 IC2.6 R25.2 | BEND.3 48.26,2.54 v46.99,3.81 v36.83,3.81 | v64.77,76.2 59.69,81.28 35.56,81.28 19.05,64.77 v19.05,58.42
N$56  (via drill 0.33)
  Top 0.406: 87.63,46.99 IC2.5 | 87.63,46.99 87.63,53.34 C5.+ | v63.5,7.62 DECAY.1 | v92.71,26.67 87.63,31.75 87.63,46.99
  Bottom 0.406: DECAY.1 DECAY.2 | C5.+ D3.C | v63.5,7.62 72.39,7.62 77.47,12.7 81.28,12.7 83.82,15.24 86.36,15.24 88.9,17.78 93.98,17.78 95.25,19.05 95.25,26.67 v92.71,26.67
N$57
  Top 0.406: R18.2 87.63,66.04 87.63,74.93 85.09,77.47 60.96,77.47 60.96,78.74 59.69,80.01 38.1,80.01 38.1,71.12 35.56,68.58 35.56,59.69 40.64,54.61 40.64,48.26 35.56,43.18 35.56,36.83 33.02,34.29 33.02,30.48 38.1,25.4 40.64,25.4 41.91,24.13 41.91,16.51 44.45,13.97 44.45,11.43 45.72,10.16 55.88,10.16 55.88,6.35 58.42,3.81 DECAY.3
N$58
  Bottom 0.406: D6.A 96.52,46.99 R25.1
N$59  (via drill 0.33)
  Top 0.406: v41.91,7.62 UP/DOWN.2
  Bottom 0.406: R27.1 v41.91,7.62
N$60
  Top 0.406: R27.2 45.72,6.35 45.72,3.81 46.99,2.54 49.53,5.08 52.07,5.08 BEND.2
N$61
  Top 0.406: UP/DOWN.1 39.37,7.62 R28.2
N$62  (via drill 0.33)
  Top 0.406: v95.25,16.51 v95.25,13.97
  Bottom 0.406: R21.2 87.63,12.7 93.98,12.7 v95.25,13.97 | v95.25,16.51 99.06,20.32 99.06,25.4 S3.3
N$63
  Top 0.406: R74.2 15.24,36.83 16.51,36.83 C15.2
  Bottom 0.406: T8.E C15.2
N$64
  Top 0.406: IC11.2 13.97,31.75 16.51,31.75 C15.1 | R75.2 12.7,22.86 12.7,25.4 R76.2
  Bottom 0.406: R76.2 C15.1
N$65
  Bottom 0.406: PITCH_CV.1 100.33,52.07 101.6,52.07 101.6,46.99 97.79,46.99 93.98,43.18 R100*.1
N$66  (via drill 0.33)
  Top 0.406: v82.55,7.62 81.28,6.35 RATE.1
  Bottom 0.406: R73.2 88.9,8.89 83.82,8.89 v82.55,7.62
N$67
  Top 0.406: GAIN.3 24.13,5.08 26.67,5.08 29.21,7.62 30.48,7.62 R61.2
  Bottom 0.406: GAIN.3 GAIN.2
N$70  (via drill 0.33)
  Top 0.406: v80.01,21.59 82.55,24.13 v82.55,25.4
  Bottom 0.406: 99.06,31.75 99.06,33.02 S2.2 | 99.06,31.75 99.06,29.21 97.79,27.94 92.71,27.94 C14.2 v82.55,25.4 | IC7.1 78.74,21.59 v80.01,21.59 | 99.06,31.75 93.98,31.75 | 93.98,31.75 R68.1 | S1.1 100.33,36.83 99.06,36.83 93.98,31.75
N$71
  Top 0.406: R70.1 83.82,17.78 83.82,21.59 86.36,24.13 86.36,26.67 IC7.5
  Bottom 0.406: IC7.5 88.9,31.75 R68.2
N$72
  Top 0.406: RATE.3 76.2,6.35 74.93,7.62 74.93,11.43 R70.2 78.74,17.78 78.74,26.67 IC7.7
  Bottom 0.406: IC7.7 81.28,26.67 90.17,26.67 92.71,29.21 D4.A | R67.2 R70.2
N$74  (via drill 0.33)
  Top 0.406: v87.63,13.97 R69.2 | RATE.2 v78.74,6.35
  Bottom 0.406: v87.63,13.97 85.09,11.43 80.01,11.43 78.74,10.16 v78.74,6.35
N$75  (via drill 0.33)
  Top 0.406: IC7.2 v82.55,17.78 | R69.1 91.44,15.24 91.44,17.78 v90.17,19.05
  Bottom 0.406: C13.1 90.17,21.59 88.9,21.59 86.36,19.05 | 86.36,19.05 85.09,17.78 v82.55,17.78 | 86.36,19.05 v90.17,19.05
N$76  (via drill 0.33)
  Top 0.406: v96.52,33.02 93.98,30.48 93.98,27.94 95.25,26.67 95.25,21.59 C13.2
  Bottom 0.406: C13.2 C14.1 | S2.3 97.79,33.02 v96.52,33.02
N$77
  Bottom 0.406: D4.C 96.52,44.45 99.06,44.45 S1.3
N$78
  Top 0.406: S3.2 97.79,22.86 97.79,41.91 99.06,43.18 S1.2
N$79
  Top 0.406: DEPTH.3 R21.1
N$80  (via drill 0.33)
  Top 0.406: v86.36,6.35 87.63,5.08 DEPTH.2
  Bottom 0.406: R24.1 82.55,6.35 v86.36,6.35
N$81
  Bottom 0.406: R107.2 6.35,20.32 PITCH.2
N$82
  Top 0.406: R106.1 17.78,11.43 R107.1
  Bottom 0.406: R33.2 34.29,17.78 20.32,17.78 R107.1
N$84
  Bottom 0.406: D7.A 97.79,15.24 87.63,15.24 86.36,13.97 R67.1
N$86
  Bottom 0.406: X1.1 X1.2 7.62,73.66 13.97,80.01 22.86,80.01 26.67,76.2 | 26.67,76.2 22.86,72.39 22.86,69.85 L1.1 | 26.67,76.2 J3.1
N$87
  Top 0.406: X1.10 12.7,57.15 12.7,67.31 15.24,69.85 L2.1
  Bottom 0.406: X1.10 X1.9 | L2.1 15.24,69.85 15.24,76.2 J3.4
N$88  (via drill 0.33)
  Top 0.406: IC7.8 82.55,33.02 82.55,36.83 83.82,38.1 83.82,43.18 78.74,48.26 74.93,48.26 74.93,52.07 v71.12,55.88
  Bottom 0.406: v71.12,55.88 71.12,58.42 62.23,58.42 60.96,59.69 60.96,72.39 58.42,72.39 57.15,73.66 49.53,73.66 48.26,72.39 36.83,72.39 R71.1
N$89
  Top 0.406: P_TRIG.1 76.2,78.74 80.01,78.74 JMP.1
  Bottom 0.406: JMP.1 D1.A
NOISE  (via drill 0.33)
  Top 0.406: R102.1 30.48,15.24 v30.48,20.32
  Bottom 0.406: IC11.6 8.89,31.75 19.05,31.75 19.05,26.67 | R76.1 19.05,26.67 | v30.48,20.32 26.67,24.13 26.67,26.67 19.05,26.67

### Text on the board
tNames: Simmons SDS3 | μ-rave | rev1 2013 | THeff / xpmtl / jmej / xnor | Extra extra EXTRA thanks to THeff!